# Altium project HAB-Main-Flight-Computer-Card-Template.PrjPcb (part 1 of 4)
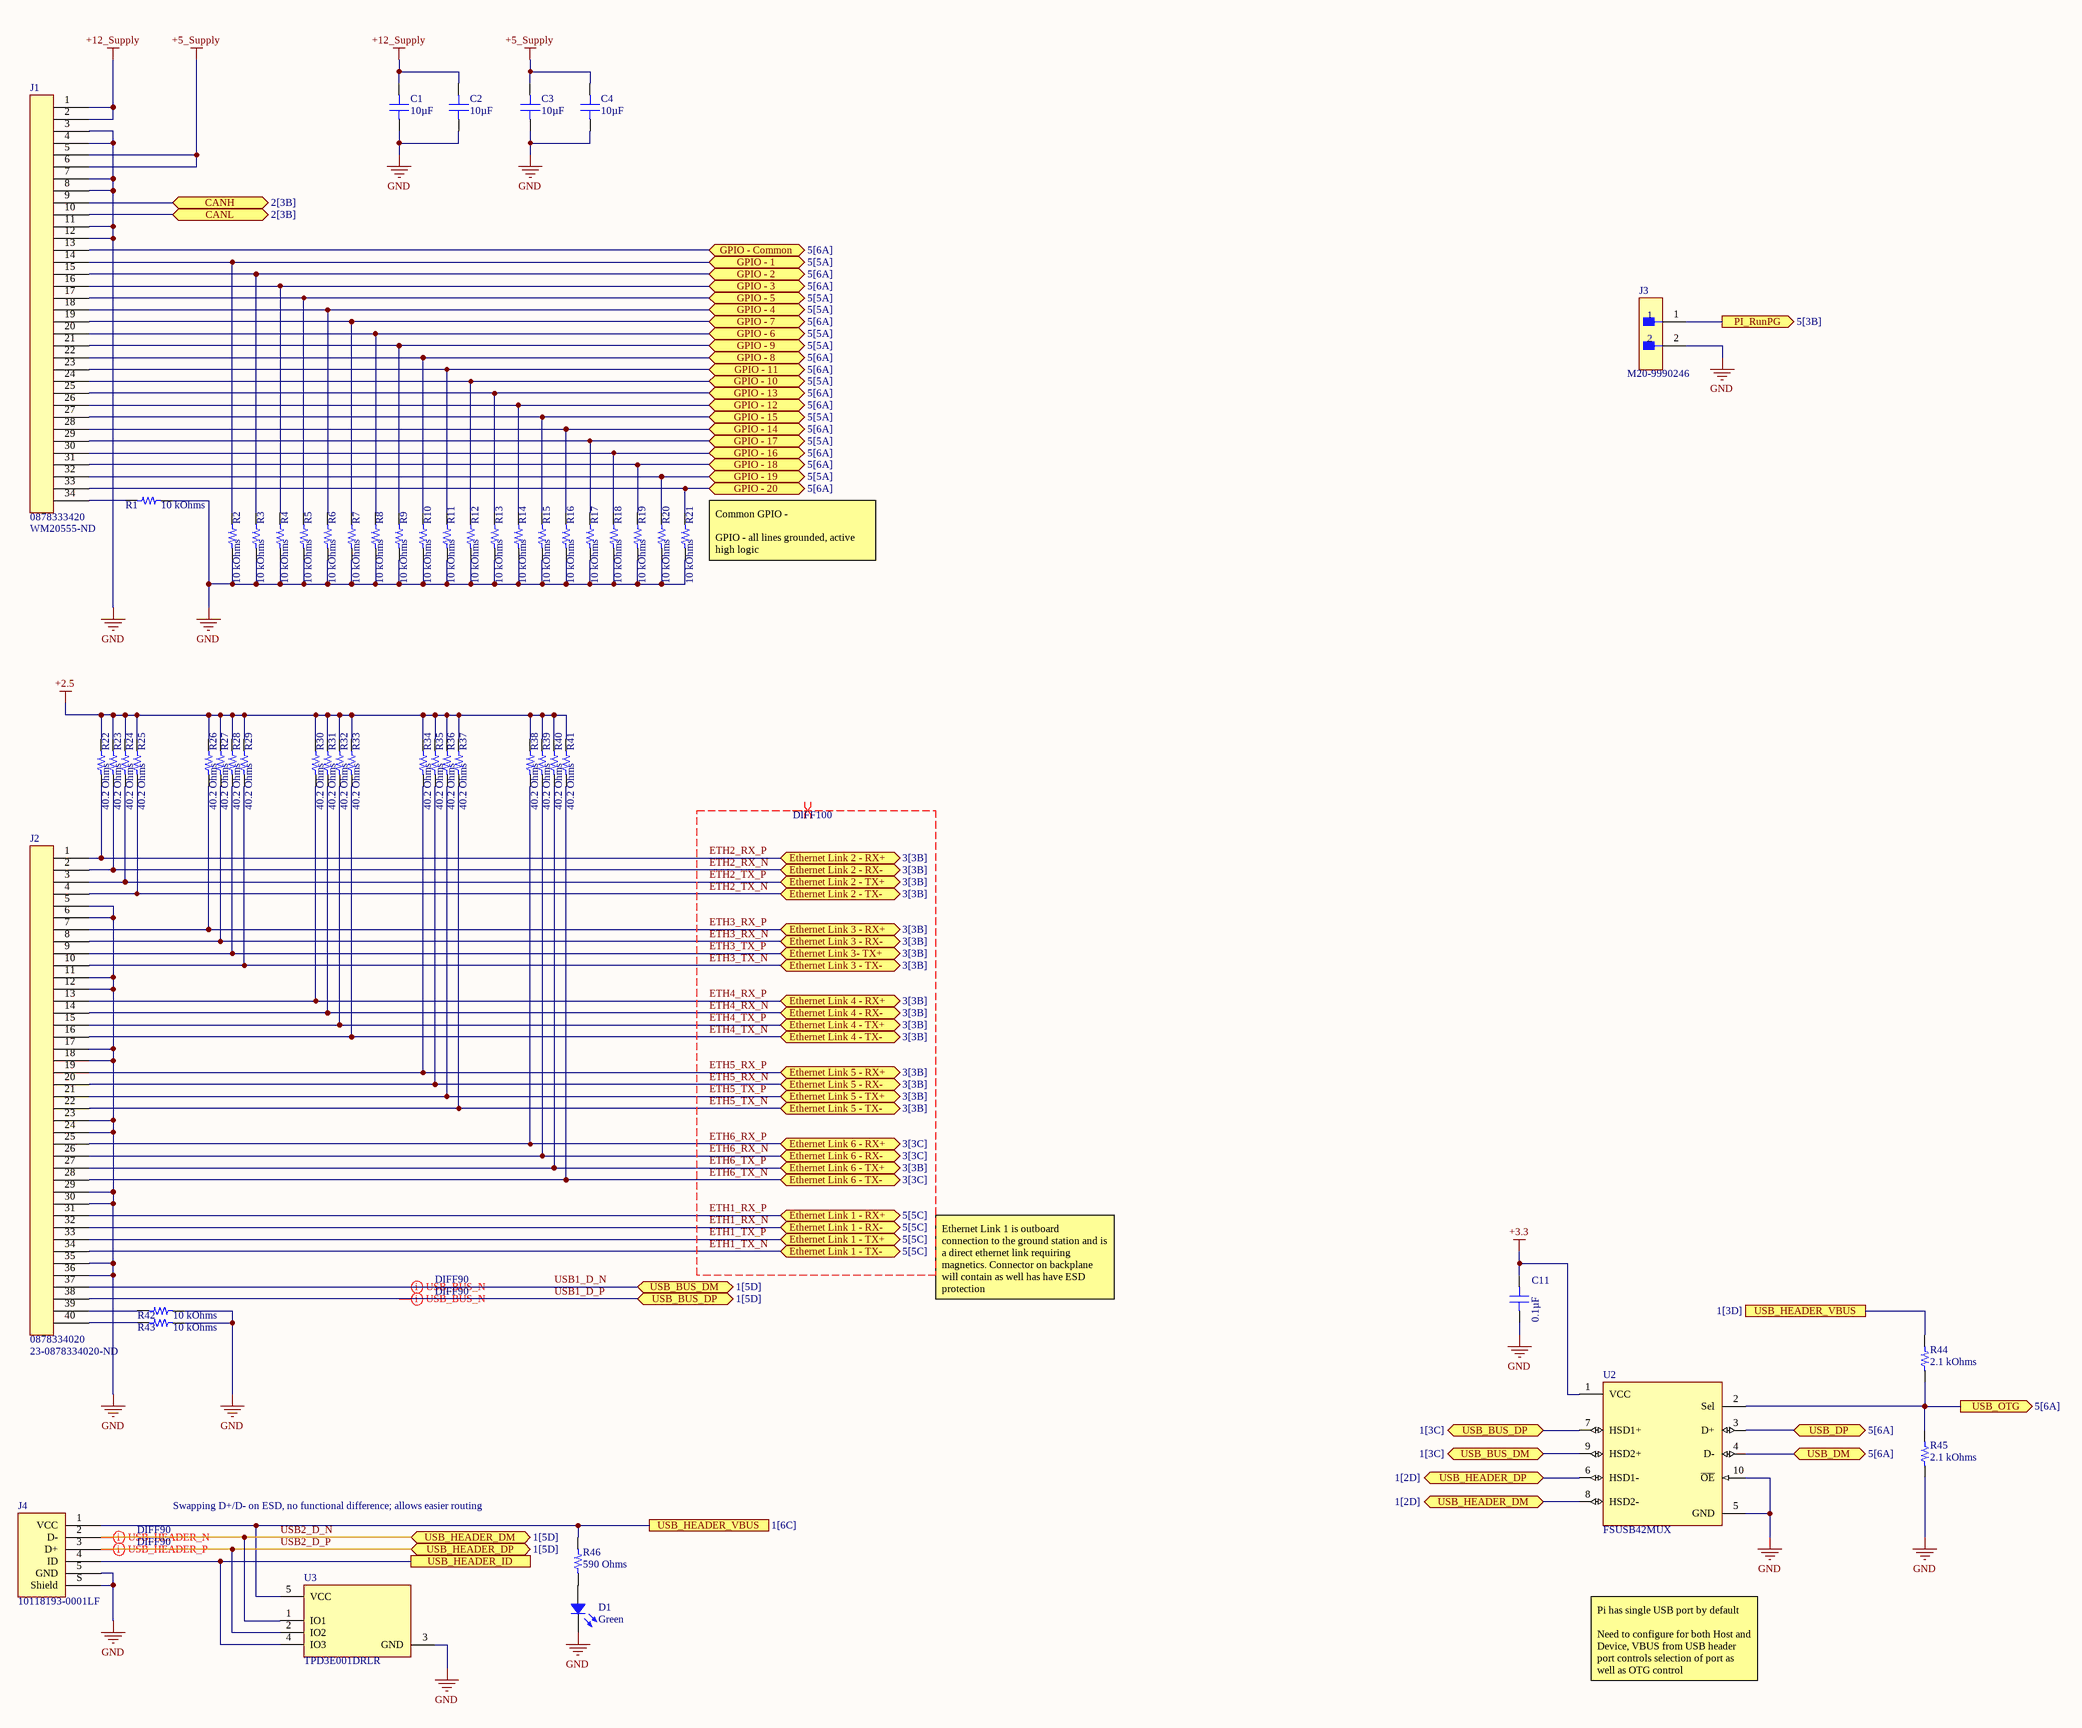
[diagram p0: Interfaces.SchDoc]
7 sheets, 292 parts. Net scope: flat (ports and power ports of the same name join across sheets).
Board file: MFC-Card-Template.PcbDoc
Sheets:
  Interfaces.SchDoc
  CANbus.SchDoc
  NetworkSwitch.SchDoc
  EthernetBridge.SchDoc
  ComputeModule.SchDoc
  Sensors.SchDoc
  Power-Supplies.SchDoc

## Sheet Interfaces.SchDoc: Main Flight Computer Interfaces
size A2; Revision: 1A; SheetNumber: 1; SheetTotal: 7; Organization: Brickworks; Address1: Matthew Glazer; Address2: Design Engineer

### Parts
C1  10µF  [CAP 0805_2012]
C2  10µF  [CAP 0805_2012]
C3  10µF  [CAP 0805_2012]
C4  10µF  [CAP 0805_2012]
C11  0.1µF  [CAP 0603_1608]
D1  Green  [LED 0603_1608 GREEN]
J1  0878333420  Supplier Part Number 1: WM20555-ND  [0878333420]
J2  0878334020  Supplier Part Number 1: 23-0878334020-ND  [0878334020]
J3  M20-9990246  [FP-M20-9990246-MFG]
J4  10118193-0001LF  [FCI USB 10118193-0001LF]
R1  10 kOhms  [RES 0603_1608]
R2  10 kOhms  [RES 0603_1608]
R3  10 kOhms  [RES 0603_1608]
R4  10 kOhms  [RES 0603_1608]
R5  10 kOhms  [RES 0603_1608]
R6  10 kOhms  [RES 0603_1608]
R7  10 kOhms  [RES 0603_1608]
R8  10 kOhms  [RES 0603_1608]
R9  10 kOhms  [RES 0603_1608]
R10  10 kOhms  [RES 0603_1608]
R11  10 kOhms  [RES 0603_1608]
R12  10 kOhms  [RES 0603_1608]
R13  10 kOhms  [RES 0603_1608]
R14  10 kOhms  [RES 0603_1608]
R15  10 kOhms  [RES 0603_1608]
R16  10 kOhms  [RES 0603_1608]
R17  10 kOhms  [RES 0603_1608]
R18  10 kOhms  [RES 0603_1608]
R19  10 kOhms  [RES 0603_1608]
R20  10 kOhms  [RES 0603_1608]
R21  10 kOhms  [RES 0603_1608]
R22  40.2 Ohms  [RES 0603_1608]
R23  40.2 Ohms  [RES 0603_1608]
R24  40.2 Ohms  [RES 0603_1608]
R25  40.2 Ohms  [RES 0603_1608]
R26  40.2 Ohms  [RES 0603_1608]
R27  40.2 Ohms  [RES 0603_1608]
R28  40.2 Ohms  [RES 0603_1608]
R29  40.2 Ohms  [RES 0603_1608]
R30  40.2 Ohms  [RES 0603_1608]
R31  40.2 Ohms  [RES 0603_1608]
R32  40.2 Ohms  [RES 0603_1608]
R33  40.2 Ohms  [RES 0603_1608]
R34  40.2 Ohms  [RES 0603_1608]
R35  40.2 Ohms  [RES 0603_1608]
R36  40.2 Ohms  [RES 0603_1608]
R37  40.2 Ohms  [RES 0603_1608]
R38  40.2 Ohms  [RES 0603_1608]
R39  40.2 Ohms  [RES 0603_1608]
R40  40.2 Ohms  [RES 0603_1608]
R41  40.2 Ohms  [RES 0603_1608]
R42  10 kOhms  [RES 0603_1608]
R43  10 kOhms  [RES 0603_1608]
R44  2.1 kOhms  [RES 0603_1608]
R45  2.1 kOhms  [RES 0603_1608]
R46  590 Ohms  [RES 0603_1608]
U2  FSUSB42MUX  [FP-846AP-MFG]
U3  TPD3E001DRLR  [FP-DRL0005A-MFG]

### Ports
CANH (bidir, see 2[3B]), CANL (bidir, see 2[3B]), Ethernet Link 1 - RX+ (bidir, see 5[5C]), Ethernet Link 1 - RX- (bidir, see 5[5C]), Ethernet Link 1 - TX+ (bidir, see 5[5C]), Ethernet Link 1 - TX- (bidir, see 5[5C]), Ethernet Link 2 - RX+ (bidir, see 3[3B]), Ethernet Link 2 - RX- (bidir, see 3[3B]), Ethernet Link 2 - TX+ (bidir, see 3[3B]), Ethernet Link 2 - TX- (bidir, see 3[3B]), Ethernet Link 3 - RX+ (bidir, see 3[3B]), Ethernet Link 3 - RX- (bidir, see 3[3B]), Ethernet Link 3 - TX- (bidir, see 3[3B]), Ethernet Link 3- TX+ (bidir, see 3[3B]), Ethernet Link 4 - RX+ (bidir, see 3[3B]), Ethernet Link 4 - RX- (bidir, see 3[3B]), Ethernet Link 4 - TX+ (bidir, see 3[3B]), Ethernet Link 4 - TX- (bidir, see 3[3B]), Ethernet Link 5 - RX+ (bidir, see 3[3B]), Ethernet Link 5 - RX- (bidir, see 3[3B]), Ethernet Link 5 - TX+ (bidir, see 3[3B]), Ethernet Link 5 - TX- (bidir, see 3[3B]), Ethernet Link 6 - RX+ (bidir, see 3[3C]), Ethernet Link 6 - RX- (bidir, see 3[3C]), Ethernet Link 6 - TX+ (bidir, see 3[3B]), Ethernet Link 6 - TX- (bidir, see 3[3C]), GPIO - 1 (bidir, see 5[5A]), GPIO - 2 (bidir, see 5[6A]), GPIO - 3 (bidir, see 5[6A]), GPIO - 4 (bidir, see 5[5A]), GPIO - 5 (bidir, see 5[5A]), GPIO - 6 (bidir, see 5[5A]), GPIO - 7 (bidir, see 5[6A]), GPIO - 8 (bidir, see 5[6A]), GPIO - 9 (bidir, see 5[5A]), GPIO - 10 (bidir, see 5[5A]), GPIO - 11 (bidir, see 5[6A]), GPIO - 12 (bidir, see 5[6A]), GPIO - 13 (bidir, see 5[6A]), GPIO - 14 (bidir, see 5[6A]), GPIO - 15 (bidir, see 5[5A]), GPIO - 16 (bidir, see 5[6A]), GPIO - 17 (bidir, see 5[5A]), GPIO - 18 (bidir, see 5[6A]), GPIO - 19 (bidir, see 5[5A]), GPIO - 20 (bidir, see 5[6A]), GPIO - Common (bidir, see 5[6A]), PI_RunPG (out, see 5[3B]), USB_BUS_DM (bidir, see 1[3C]), USB_BUS_DM (bidir, see 1[5D]), USB_BUS_DP (bidir, see 1[3C]), USB_BUS_DP (bidir, see 1[5D]), USB_DM (bidir, see 5[6A]), USB_DP (bidir, see 5[6A]), USB_HEADER_DM (bidir, see 1[2D]), USB_HEADER_DM (bidir, see 1[5D]), USB_HEADER_DP (bidir, see 1[2D]), USB_HEADER_DP (bidir, see 1[5D]), USB_HEADER_ID, USB_HEADER_VBUS (see 1[3D]), USB_HEADER_VBUS (see 1[6C]), USB_OTG (out, see 5[6A])

### Nets
+2.5: R22.2 R23.2 R24.2 R25.2 R26.2 R27.2 R28.2 R29.2 R30.2 R31.2 R32.2 R33.2 R34.2 R35.2 R36.2 R37.2 R38.2 R39.2 R40.2 R41.2
+3.3: C11.2 U2.1(VCC)
+5_Supply: C3.2 C4.2 J1.5 J1.6
+12_Supply: C1.2 C2.2 J1.1 J1.2
GND: C1.1 C2.1 C3.1 C4.1 C11.1 D1.2 J1.3 J1.4 J1.7 J1.8 J1.11 J1.12 J2.5 J2.6 J2.11 J2.12 J2.17 J2.18 J2.23 J2.24 J2.29 J2.30 J2.35 J2.36 J3.2 J4.5(GND) J4.S(Shield) R1.2 R2.1 R3.1 R4.1 R5.1 R6.1 R7.1 R8.1 R9.1 R10.1 R11.1 R12.1 R13.1 R14.1 R15.1 R16.1 R17.1 R18.1 R19.1 R20.1 R21.1 R42.2 R43.2 R45.1 U2.5(GND) U2.10(~{OE}) U3.3(GND)
ETH1_RX_N: J2.32 ; port Ethernet Link 1 - RX-
ETH1_RX_P: J2.31 ; port Ethernet Link 1 - RX+
ETH1_TX_N: J2.34 ; port Ethernet Link 1 - TX-
ETH1_TX_P: J2.33 ; port Ethernet Link 1 - TX+
ETH2_RX_N: J2.2 R23.1 ; port Ethernet Link 2 - RX-
ETH2_RX_P: J2.1 R22.1 ; port Ethernet Link 2 - RX+
ETH2_TX_N: J2.4 R25.1 ; port Ethernet Link 2 - TX-
ETH2_TX_P: J2.3 R24.1 ; port Ethernet Link 2 - TX+
ETH3_RX_N: J2.8 R27.1 ; port Ethernet Link 3 - RX-
ETH3_RX_P: J2.7 R26.1 ; port Ethernet Link 3 - RX+
ETH3_TX_N: J2.10 R29.1 ; port Ethernet Link 3 - TX-
ETH3_TX_P: J2.9 R28.1 ; port Ethernet Link 3- TX+
ETH4_RX_N: J2.14 R31.1 ; port Ethernet Link 4 - RX-
ETH4_RX_P: J2.13 R30.1 ; port Ethernet Link 4 - RX+
ETH4_TX_N: J2.16 R33.1 ; port Ethernet Link 4 - TX-
ETH4_TX_P: J2.15 R32.1 ; port Ethernet Link 4 - TX+
ETH5_RX_N: J2.20 R35.1 ; port Ethernet Link 5 - RX-
ETH5_RX_P: J2.19 R34.1 ; port Ethernet Link 5 - RX+
ETH5_TX_N: J2.22 R37.1 ; port Ethernet Link 5 - TX-
ETH5_TX_P: J2.21 R36.1 ; port Ethernet Link 5 - TX+
ETH6_RX_N: J2.26 R39.1 ; port Ethernet Link 6 - RX-
ETH6_RX_P: J2.25 R38.1 ; port Ethernet Link 6 - RX+
ETH6_TX_N: J2.28 R41.1 ; port Ethernet Link 6 - TX-
ETH6_TX_P: J2.27 R40.1 ; port Ethernet Link 6 - TX+
USB1_D_N: J2.37 U2.9(HSD2+) ; port USB_BUS_DM
USB1_D_P: J2.38 U2.7(HSD1+) ; port USB_BUS_DP
USB2_D_N: J4.2(D-) U2.8(HSD2-) U3.1(IO1) ; port USB_HEADER_DM
USB2_D_P: J4.3(D+) U2.6(HSD1-) U3.2(IO2) ; port USB_HEADER_DP
NetD1_1: D1.1 R46.1
NetD2_1: J1.10 ; port CANL
NetD2_2: J1.9 ; port CANH
NetJ1_13: J1.13 ; port GPIO - Common
NetJ1_14: J1.14 R2.2 ; port GPIO - 1
NetJ1_15: J1.15 R3.2 ; port GPIO - 2
NetJ1_16: J1.16 R4.2 ; port GPIO - 3
NetJ1_17: J1.17 R5.2 ; port GPIO - 5
NetJ1_18: J1.18 R6.2 ; port GPIO - 4
NetJ1_19: J1.19 R7.2 ; port GPIO - 7
NetJ1_20: J1.20 R8.2 ; port GPIO - 6
NetJ1_21: J1.21 R9.2 ; port GPIO - 9
NetJ1_22: J1.22 R10.2 ; port GPIO - 8
NetJ1_23: J1.23 R11.2 ; port GPIO - 11
NetJ1_24: J1.24 R12.2 ; port GPIO - 10
NetJ1_25: J1.25 R13.2 ; port GPIO - 13
NetJ1_26: J1.26 R14.2 ; port GPIO - 12
NetJ1_27: J1.27 R15.2 ; port GPIO - 15
NetJ1_28: J1.28 R16.2 ; port GPIO - 14
NetJ1_29: J1.29 R17.2 ; port GPIO - 17
NetJ1_30: J1.30 R18.2 ; port GPIO - 16
NetJ1_31: J1.31 R19.2 ; port GPIO - 18
NetJ1_32: J1.32 R20.2 ; port GPIO - 19
NetJ1_33: J1.33 R21.2 ; port GPIO - 20
NetJ1_34: J1.34 R1.1
NetJ2_39: J2.39 R42.1
NetJ2_40: J2.40 R43.1
NetJ3_1: J3.1 ; port PI_RunPG
NetJ4_1: J4.1(VCC) R44.2 R46.2 U3.5(VCC) ; port USB_HEADER_VBUS
NetJ4_4: J4.4(ID) U3.4(IO3) ; port USB_HEADER_ID
NetR44_1: R44.1 R45.2 U2.2(Sel) ; port USB_OTG
NetU1_103: U2.4(D-) ; port USB_DM
NetU1_105: U2.3(D+) ; port USB_DP

### Layout directives
differential pair; differential pair class DIFF90: USB1_D_N, USB1_D_P, USB2_D_N, USB2_D_P
differential pair; differential pair class DIFF100: ETH1_RX_N, ETH1_RX_P, ETH1_TX_N, ETH1_TX_P, ETH2_RX_N, ETH2_RX_P, ETH2_TX_N, ETH2_TX_P, ETH3_RX_N, ETH3_RX_P, ETH3_TX_N, ETH3_TX_P, ETH4_RX_N, ETH4_RX_P, ETH4_TX_N, ETH4_TX_P, ETH5_RX_N, ETH5_RX_P, ETH5_TX_N, ETH5_TX_P, ETH6_RX_N, ETH6_RX_P, ETH6_TX_N, ETH6_TX_P

### Notes on the sheet
- (near R21) Common GPIO -
  GPIO - all lines grounded, active high logic
- Ethernet Link 1 is outboard connection to the ground station and is a direct ethernet link requiring magnetics. Connector on backplane will contain as well has have ESD protection
- (near R46) Swapping D+/D- on ESD, no functional difference; allows easier routing
- Pi has single USB port by default
  Need to configure for both Host and Device, VBUS from USB header port controls selection of port as well as OTG control
- Title
- Size:
- Date:
- File:
- A2
- Number:
- Time:
- Revision:
- Sheet
- of

### Library data of the parts
C1-C4 = CC0805KKX5R7BB106: CAP CER 10UF 16V X5R 0805; Manufacturer: Yageo; Tolerance: ±10%; Part Number: CC0805KKX5R7BB106; Value: 10µF; Applications: General Purpose; Capacitance: 10µF; ComponentLink1Description: Datasheet; ComponentLink1URL: https://www.yageo.com/upload/media/product/productsearch/datasheet/mlcc/UPY-GPHC_X5R_4V-to-50V_25.pdf; ComponentLink2Description: DigiKey Link; ComponentLink2URL: http://digikey.com/product-detail/en/yageo/CC0805KKX5R7BB106/311-1865-1-ND/5195767; Device Package: 0805 (2012 Metric); LastUpdated: 9/2/2020 1:04:30 AM; Lifecycle Status: Active; Minimum Order: 1; Mounting Type: Surface Mount, MLCC; Operating Temperature: -55°C ~ 85°C; Package / Case: 0805 (2012 Metric); Packaging: TapeAndReel; PartId: 8867; Part Status: Active; Price: 0.09; Series: CC; Size / Dimension: 0.079" L x 0.049" W (2.00mm x 1.25mm); Supplier 1: DigiKey; Supplier Part Number 1: 311-1865-1-ND; Temperature Coefficient: X5R; Thickness (Max): 0.057" (1.45mm); Voltage - Rated: 16V
C11 = CL10B104KA8WPNC: CAP CER 0.1UF 25V X7R 0603; Manufacturer: Samsung Electro-Mechanics; Tolerance: ±10%; Part Number: CL10B104KA8WPNC; Value: 0.1µF; Applications: Automotive; Capacitance: 0.1µF; ComponentLink1Description: Datasheet; ComponentLink1URL: http://www.samsungsem.com/kr/support/product-search/mlcc/CL10B104KA8WPNC.jsp; ComponentLink2Description: DigiKey Link; ComponentLink2URL: http://digikey.com/product-detail/en/samsung-electro-mechanics/CL10B104KA8WPNC/1276-6717-1-ND/5961576; Device Package: 0603 (1608 Metric); Features: Open Mode; LastUpdated: 9/2/2020 1:03:30 AM; Lifecycle Status: Active; Minimum Order: 1; Mounting Type: Surface Mount, MLCC; Operating Temperature: -55°C ~ 125°C; Package / Case: 0603 (1608 Metric); Packaging: TapeAndReel; PartId: 5631; Part Status: Active; Price: 0.02; Ratings: AEC-Q200; Series: CL; Size / Dimension: 0.063" L x 0.031" W (1.60mm x 0.80mm); Supplier 1: DigiKey; Supplier Part Number 1: 1276-6717-1-ND; Temperature Coefficient: X7R; Thickness (Max): 0.035" (0.90mm); Voltage - Rated: 25V
D1 = LTST-C193KGKT-5A: LED GREEN CLEAR CHIP SMD; Manufacturer: Lite-On Inc.; Configuration: Standard; Current - Test: 5mA; Lens Color: Colorless; Lens Size: 1.15mm x 0.80mm; Lens Style: Rectangle with Flat Top; Millicandela Rating: 16.25mcd; Viewing Angle: 130°; Voltage - Forward (Vf) (Typ): 2V; Wavelength - Dominant: 572nm; Wavelength - Peak: 574nm; Part Number: LTST-C193KGKT-5A; Color: Green; ComponentLink1Description: Datasheet; ComponentLink1URL: http://optoelectronics.liteon.com/upload/download/DS22-2007-0094/LTST-C193KGKT-5A.PDF; ComponentLink2Description: DigiKey Link; ComponentLink2URL: http://digikey.com/product-detail/en/lite-on-inc/LTST-C193KGKT-5A/160-1828-1-ND/2356247; Device Package: 0603 (1608 Metric); Height (Max): 0.45mm; LastUpdated: 9/2/2020 1:20:41 AM; Lens Transparency: Clear; Lifecycle Status: Active; Minimum Order: 1; Mounting Type: Surface Mount; Package / Case: 0603 (1608 Metric); Packaging: TapeAndReel; PartId: 694; Part Status: Active; Price: 0.06; Series: -; Size / Dimension: 1.60mm L x 0.80mm W; Supplier 1: DigiKey; Supplier Part Number 1: 160-1828-1-ND; Supplier Device Package: Chip LED; Value: Green
J3 = CMP-15831-000009-1: CONN HEADER VERT 2POS 2.54MM; Manufacturer: Harwin; Conn Gender: Male; Conn Orientation: Vertical; Number Of Contacts: 2; Current Rating: 3A; ComponentLink2URL: https://cdn.harwin.com/pdfs/M20-999.pdf; ComponentLink2Description: Datasheet; Package: M20-9990246; Temperature: -40°C to +105°C; Octopart: https://octopart.com/m20-9990246-harwin-2590635; Mouser Description: 2.54mm (0.1") Pitch SIL Vertical PC Tail Pin Header, 6.1mm mating pin height, tin, 2 contacts; Temperature Range High: +105°C; Device Class L1: Connectors; RoHS: TRUE; Automotive: No; Height: 8.99mm; Number Of Rows: 1; Contact Material: Tin,Nickel; Category: Conn; Pitch: 2.54mm; Lead Free: Yes; Digikey Description: CONN HEADER VERT 2POS 2.54MM; Manufacturer Part Number: M20-9990246; Temperature Range Low: -40°C; Device Class L3: unset; Device Class L2: Headers and Wire Housings
J4 = 10118193-0001LF: CONN RCPT USB2.0 MICRO B SMD R/A; Manufacturer: Amphenol ICC (FCI); Connector Type: USB - micro B; Current Rating (Amps): 1.8A per Contact; Gender: Receptacle; Mating Cycles: 10000; Number of Contacts: 5; Number of Ports: 1; Shielding: Shielded; Voltage - Rated: 100VAC; Part Number: 10118193-0001LF; ComponentLink1Description: Datasheet; ComponentLink1URL: https://cdn.amphenol-icc.com/media/wysiwyg/files/documentation/datasheet/inputoutput/io_usb_micro.pdf; ComponentLink2Description: DigiKey Link; ComponentLink2URL: //digikey.com/product-detail/en/amphenol-icc-fci/10118193-0001LF/609-4616-2-ND/2785388; Features: Solder Retention; LastUpdated: 12/9/2019 8:51:28 PM; Lifecycle Status: 0; Minimum Order: 1; Mounting Feature: Horizontal; Mounting Type: Surface Mount, Right Angle; Through Hole; Operating Temperature: -30°C ~ 80°C; Packaging: TapeAndReel; Part Status: Active; Price: 0.21; Series: -; Specifications: USB 2.0; Supplier 1: DigiKey; Supplier Part Number 1: 609-4616-2-ND; Termination: Solder
R1-R21 R42 R43 = RMCF0603JT10K0: RES 10K OHM 5% 1/10W 0603; Manufacturer: Stackpole Electronics Inc; Power (Watts): 0.1W, 1/10W; Temperature Coefficient: ±200ppm/°C; Part Number: RMCF0603JT10K0; Value: 10 kOhms; ComponentLink1Description: Datasheet; ComponentLink1URL: https://www.seielect.com/catalog/sei-packaging.pdf; ComponentLink2Description: DigiKey Link; ComponentLink2URL: http://digikey.com/product-detail/en/stackpole-electronics-inc/RMCF0603JT10K0/RMCF0603JT10K0CT-ND/1943191; Composition: Thick Film; Device Package: 0603 (1608 Metric); Features: Automotive AEC-Q200; Height - Seated (Max): 0.022" (0.55mm); LastUpdated: 9/2/2020 1:09:31 AM; Lifecycle Status: Active; Minimum Order: 1; Number of Terminations: 2; Operating Temperature: -55°C ~ 155°C; Package / Case: 0603 (1608 Metric); Packaging: CutTape; PartId: 25659; Part Status: Active; Price: 0.10; Ratings: AEC-Q200; Resistance: 10 kOhms; Series: RMCF; Size / Dimension: 0.061" L x 0.031" W (1.55mm x 0.80mm); Supplier 1: DigiKey; Supplier Part Number 1: RMCF0603JT10K0CT-ND; Supplier Device Package: 0603; Tolerance: ±5%
R22-R41 = RC0603FR-0740R2L: RES SMD 40.2 OHM 1% 1/10W 0603; Manufacturer: Yageo; Power (Watts): 0.1W, 1/10W; Temperature Coefficient: ±100ppm/°C; Part Number: RC0603FR-0740R2L; Value: 40.2 Ohms; ComponentLink1Description: Datasheet; ComponentLink1URL: https://www.yageo.com/upload/media/product/productsearch/datasheet/rchip/PYu-RC_Group_51_RoHS_L_10.pdf; ComponentLink2Description: DigiKey Link; ComponentLink2URL: http://digikey.com/product-detail/en/yageo/RC0603FR-0740R2L/311-40.2HRCT-ND/730167; Composition: Thick Film; Device Package: 0603 (1608 Metric); Features: Moisture Resistant; Height - Seated (Max): 0.022" (0.55mm); LastUpdated: 9/2/2020 1:10:19 AM; Lifecycle Status: Active; Minimum Order: 1; Number of Terminations: 2; Operating Temperature: -55°C ~ 155°C; Package / Case: 0603 (1608 Metric); Packaging: CutTape; PartId: 7714; Part Status: Active; Price: 0.10; Resistance: 40.2 Ohms; Series: RC; Size / Dimension: 0.063" L x 0.031" W (1.60mm x 0.80mm); Supplier 1: DigiKey; Supplier Part Number 1: 311-40.2HRCT-ND; Supplier Device Package: 0603; Tolerance: ±1%
R44 R45 = RMCF0603FT2K10: RES 2.1K OHM 1% 1/10W 0603; Manufacturer: Stackpole Electronics Inc; Power (Watts): 0.1W, 1/10W; Temperature Coefficient: ±100ppm/°C; Part Number: RMCF0603FT2K10; Value: 2.1 kOhms; ComponentLink1Description: Datasheet; ComponentLink1URL: https://www.seielect.com/catalog/sei-rmcf_rmcp.pdf; ComponentLink2Description: DigiKey Link; ComponentLink2URL: http://digikey.com/product-detail/en/stackpole-electronics-inc/RMCF0603FT2K10/RMCF0603FT2K10CT-ND/5049755; Composition: Thick Film; Device Package: 0603 (1608 Metric); Features: Automotive AEC-Q200; Height - Seated (Max): 0.022" (0.55mm); LastUpdated: 9/2/2020 1:10:13 AM; Lifecycle Status: Active; Minimum Order: 1; Number of Terminations: 2; Operating Temperature: -55°C ~ 155°C; Package / Case: 0603 (1608 Metric); Packaging: CutTape; PartId: 10871; Part Status: Active; Price: 0.10; Ratings: AEC-Q200; Resistance: 2.1 kOhms; Series: RMCF; Size / Dimension: 0.061" L x 0.031" W (1.55mm x 0.80mm); Supplier 1: DigiKey; Supplier Part Number 1: RMCF0603FT2K10CT-ND; Supplier Device Package: 0603; Tolerance: ±1%
R46 = RMCF0603FT590R: RES 590 OHM 1% 1/10W 0603; Manufacturer: Stackpole Electronics Inc; Power (Watts): 0.1W, 1/10W; Temperature Coefficient: ±100ppm/°C; Part Number: RMCF0603FT590R; Value: 590 Ohms; ComponentLink1Description: Datasheet; ComponentLink1URL: https://www.seielect.com/catalog/sei-rmcf_rmcp.pdf; ComponentLink2Description: DigiKey Link; ComponentLink2URL: http://digikey.com/product-detail/en/stackpole-electronics-inc/RMCF0603FT590R/RMCF0603FT590RCT-ND/2418096; Composition: Thick Film; Device Package: 0603 (1608 Metric); Features: Automotive AEC-Q200; Height - Seated (Max): 0.022" (0.55mm); LastUpdated: 9/2/2020 1:09:40 AM; Lifecycle Status: Active; Minimum Order: 1; Number of Terminations: 2; Operating Temperature: -55°C ~ 155°C; Package / Case: 0603 (1608 Metric); Packaging: CutTape; PartId: 23847; Part Status: Active; Price: 0.10; Ratings: AEC-Q200; Resistance: 590 Ohms; Series: RMCF; Size / Dimension: 0.061" L x 0.031" W (1.55mm x 0.80mm); Supplier 1: DigiKey; Supplier Part Number 1: RMCF0603FT590RCT-ND; Supplier Device Package: 0603; Tolerance: ±1%
U2 = CMP-07103-000004-1: IC USB SWITCH DPDT 10MSOP; Voltage: 4.3V; Current: 100mA; Number of Inputs: 2; Supply Type: Single; Number of Outputs: 4; Data Rate: 480Mbps; On-State Resistance: 6.5R; Min Supply Voltage: 3V; Package Quantity: 1; Length: 3mm; Radiation Hardening: No; Number of Pins: 10; Width: 3mm; Number of Channels: 2; REACH SVHC: No SVHC; Lead Free: Lead Free; Max Operating Temperature: 85°C; Min Operating Temperature: -40°C; Packaging: Tape and Reel; Throw Configuration: DPDT; Operating Supply Voltage: 4.3V; Max Supply Voltage: 4.3V; Mount: Surface Mount; Case/Package: MSOP; Weight: 0.1125g; Height: 0.85mm
U3 = CMP-0326-00052-4: TVS DIODE 5.5V SOT5; Min Supply Voltage: 900mV; Number of Bidirectional Channels: 3; Peak Pulse Power: 90W; Direction: Unidirectional; Leakage Current: 1nA; Interface: USB; Max Supply Current: 100nA; Capacitance: 1.5pF; Breakdown Voltage: 11V; Clamping Voltage: 105.5V; Power Line Protection: Yes; Packaging: Tape and Reel; Length: 1.6mm; REACH SVHC: No SVHC; Min Operating Temperature: -40°C; Lead Free: Lead Free; Max Supply Voltage: 5.5V; RoHS Compliant: Yes; Termination: SMD/SMT; Number of Channels: 3; Max Supply Voltage (DC): 5.5V; Weight: 9.9E-05oz; Package Quantity: 1; Reverse Standoff Voltage: 5.5V; Number of Pins: 5; Case/Package: SOT-553; Max Operating Temperature: 85°C; Nominal Supply Current: 1nA; Width: 1.2mm; Min Breakdown Voltage: 11V; Min Supply Voltage (DC): 900mV; Height: 0.55mm; Radiation Hardening: No; Depth: 1.2mm
J1 = 0878333420: Supplier 1: Digi-Key
J2 = 0878334020: Supplier 1: Digi-Key

## Sheet CANbus.SchDoc: Main Flight Computer CAN Bus
size A3; Revision: 1A; SheetNumber: 2; SheetTotal: 7; Organization: Brickworks; Address1: Matthew Glazer; Address2: Design Engineer
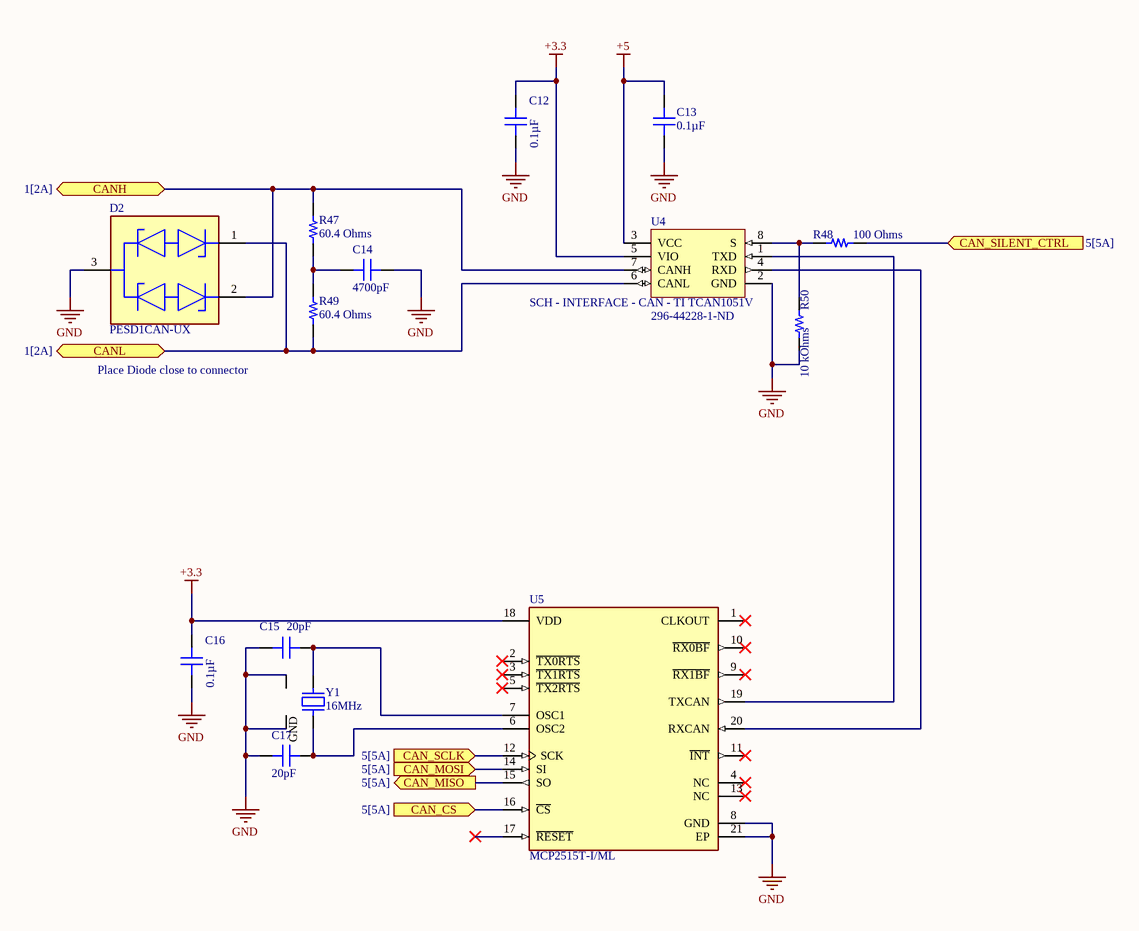
[diagram p1: CANbus.SchDoc]

### Parts
C12  0.1µF  [CAP 0603_1608]
C13  0.1µF  [CAP 0603_1608]
C14  4700pF  [CAP 0603_1608]
C15  20pF  [CAP 0603_1608]
C16  0.1µF  [CAP 0603_1608]
C17  20pF  [CAP 0603_1608]
D2  PESD1CAN-UX  [FP-SOT323-MFG]
R47  60.4 Ohms  [RES 1206_3216]
R48  100 Ohms  [RES 0603_1608]
R49  60.4 Ohms  [RES 1206_3216]
R50  10 kOhms  [RES 0603_1608]
U4  SCH - INTERFACE - CAN - TI TCAN1051V  Supplier Part Number 1: 296-44228-1-ND  [PCB - LEADS - SOIC - TI SOIC-8]
U5  MCP2515T-I/ML  [FP-C04-126-MFG]
Y1  16MHz  [EPSON TSX-3225]

### Ports
CAN_CS (in, see 5[5A]), CAN_MISO (out, see 5[5A]), CAN_MOSI (in, see 5[5A]), CAN_SCLK (in, see 5[5A]), CAN_SILENT_CTRL (in, see 5[5A]), CANH (bidir, see 1[2A]), CANL (bidir, see 1[2A])

### Nets
+3.3: C12.2 C16.2 U4.5(VIO) U5.18(VDD)
+5: C13.2 U4.3(VCC)
GND: C12.1 C13.1 C14.2 C15.1 C16.1 C17.1 D2.3(common_cathode) R50.1 U4.2(GND) U5.8(GND) U5.21(EP) Y1.2(GND) Y1.4(GND)
NetC14_1: C14.1 R47.1 R49.2
NetC15_2: C15.2 U5.7(OSC1) Y1.3
NetC17_2: C17.2 U5.6(OSC2) Y1.1
NetD2_1: D2.1(cathode_1) R49.1 U4.6(CANL) ; port CANL
NetD2_2: D2.2(cathode_2) R47.2 U4.7(CANH) ; port CANH
NetR48_1: R48.1 R50.2 U4.8(S)
NetR48_2: R48.2 ; port CAN_SILENT_CTRL
NetU1_38: U5.12(SCK) ; port CAN_SCLK
NetU1_39: U5.16(~{CS}) ; port CAN_CS
NetU1_40: U5.15(SO) ; port CAN_MISO
NetU1_44: U5.14(SI) ; port CAN_MOSI
NetU4_1: U4.1(TXD) U5.19(TXCAN)
NetU4_4: U4.4(RXD) U5.20(RXCAN)

Not connected (* = marked no-connect by the designer): U5 1(CLKOUT)* 2(~{TX0RTS})* 3(~{TX1RTS})* 4(NC)* 5(~{TX2RTS})* 9(~{RX1BF})* 10(~{RX0BF})* 11(~{INT})* 13(NC)* 17(~{RESET})*

### Notes on the sheet
- Place Diode close to connector
- Title
- Size:
- Date:
- A3
- Number:
- Time:
- Revision:
- Sheet
- of
- File:

### Library data of the parts
C12 C13 C16 = CL10B104KA8WPNC: as C11 on sheet Interfaces; Part Number: CL10B104KA8WPNC; Value: 0.1µF; Applications: Automotive; Capacitance: 0.1µF; ComponentLink1Description: Datasheet; ComponentLink1URL: http://www.samsungsem.com/kr/support/product-search/mlcc/CL10B104KA8WPNC.jsp; ComponentLink2Description: DigiKey Link; ComponentLink2URL: http://digikey.com/product-detail/en/samsung-electro-mechanics/CL10B104KA8WPNC/1276-6717-1-ND/5961576; Device Package: 0603 (1608 Metric); Features: Open Mode; LastUpdated: 9/2/2020 1:03:30 AM; Lifecycle Status: Active; Minimum Order: 1; Mounting Type: Surface Mount, MLCC; Operating Temperature: -55°C ~ 125°C; Package / Case: 0603 (1608 Metric); Packaging: TapeAndReel; PartId: 5631; Part Status: Active; Price: 0.02; Ratings: AEC-Q200; Series: CL; Size / Dimension: 0.063" L x 0.031" W (1.60mm x 0.80mm); Supplier 1: DigiKey; Supplier Part Number 1: 1276-6717-1-ND; Temperature Coefficient: X7R; Thickness (Max): 0.035" (0.90mm); Voltage - Rated: 25V
C14 = VJ0603Y472KXACW1BC: CAP CER 4700PF 50V X7R 0603; Manufacturer: Vishay Vitramon; Tolerance: ±10%; Part Number: VJ0603Y472KXACW1BC; Value: 4700pF; Applications: General Purpose; Capacitance: 4700pF; ComponentLink1Description: Datasheet; ComponentLink1URL: https://www.vishay.com/docs/28548/vjw1bcbascomseries.pdf; ComponentLink2Description: DigiKey Link; ComponentLink2URL: http://digikey.com/product-detail/en/vishay-vitramon/VJ0603Y472KXACW1BC/720-1530-1-ND/421007; Device Package: 0603 (1608 Metric); LastUpdated: 9/2/2020 1:03:13 AM; Lifecycle Status: Active; Minimum Order: 1; Mounting Type: Surface Mount, MLCC; Operating Temperature: -55°C ~ 125°C; Package / Case: 0603 (1608 Metric); Packaging: TapeAndReel; PartId: 14247; Part Status: Active; Price: 0.01; Series: VJ; Size / Dimension: 0.063" L x 0.031" W (1.60mm x 0.80mm); Supplier 1: DigiKey; Supplier Part Number 1: 720-1530-1-ND; Temperature Coefficient: X7R; Thickness (Max): 0.035" (0.90mm); Voltage - Rated: 50V
C15 C17 = CML0603C0G200JT50V: CAP CER 20PF 50V C0G/NP0 0603; Manufacturer: Stackpole Electronics Inc; Temperature Coefficient: C0G, NP0; Tolerance: ±5%; Part Number: CML0603C0G200JT50V; Value: 20pF; Applications: General Purpose; Capacitance: 20pF; ComponentLink1Description: Datasheet; ComponentLink1URL: http://www.seielect.com/Catalog/SEI-CML.PDF; ComponentLink2Description: DigiKey Link; ComponentLink2URL: http://digikey.com/product-detail/en/stackpole-electronics-inc/CML0603C0G200JT50V/738-CML0603C0G200JT50VCT-ND/10660186; Device Package: 0603 (1608 Metric); LastUpdated: 9/2/2020 1:03:28 AM; Lifecycle Status: Active; Minimum Order: 1; Mounting Type: Surface Mount, MLCC; Operating Temperature: -55°C ~ 125°C; Package / Case: 0603 (1608 Metric); Packaging: Unknown; PartId: 26340; Part Status: Active; Price: 0.01; Series: CML_C0G; Supplier 1: DigiKey; Supplier Part Number 1: 738-CML0603C0G200JT50VCT-ND; Voltage - Rated: 50V
D2 = CMP-14436-000006-1: TVS DIODE 24V 50V SC70-3
R47 R49 = ESR18EZPF60R4: RES SMD 60.4 OHM 1% 1/2W 1206; Manufacturer: Rohm Semiconductor; Power (Watts): 0.5W, 1/2W; Temperature Coefficient: ±100ppm/°C; Part Number: ESR18EZPF60R4; ComponentLink1Description: Datasheet; ComponentLink1URL: https://www.rohm.com/datasheet/ESR01MZPF/esr-e; ComponentLink2Description: DigiKey Link; ComponentLink2URL: http://digikey.com/product-detail/en/rohm-semiconductor/ESR18EZPF60R4/RHM60.4AFCT-ND/1983938; Composition: Thick Film; Device Package: 1206 (3216 Metric); Features: Automotive AEC-Q200, Pulse Withstanding; Height - Seated (Max): 0.026" (0.65mm); LastUpdated: 9/2/2020 1:12:41 AM; Lifecycle Status: Active; Minimum Order: 1; Number of Terminations: 2; Operating Temperature: -55°C ~ 155°C; Package / Case: 1206 (3216 Metric); Packaging: TapeAndReel; PartId: 38901; Part Status: Active; Price: 0.02; Ratings: AEC-Q200; Resistance: 60.4 Ohms; Series: ESR; Size / Dimension: 0.126" L x 0.063" W (3.20mm x 1.60mm); Supplier 1: DigiKey; Supplier Part Number 1: RHM60.4AFCT-ND; Supplier Device Package: 1206; Tolerance: ±1%; Value: 60.4 Ohms
R48 = RMCF0603FG100R: RES 100 OHM 1% 1/10W 0603; Manufacturer: Stackpole Electronics Inc; Power (Watts): 0.1W, 1/10W; Temperature Coefficient: ±100ppm/°C; Part Number: RMCF0603FG100R; Value: 100 Ohms; ComponentLink1Description: Datasheet; ComponentLink1URL: https://www.seielect.com/catalog/sei-rmcf_rmcp.pdf; ComponentLink2Description: DigiKey Link; ComponentLink2URL: http://digikey.com/product-detail/en/stackpole-electronics-inc/RMCF0603FG100R/RMCF0603FG100RCT-ND/4425033; Composition: Thick Film; Device Package: 0603 (1608 Metric); Features: Automotive AEC-Q200; Height - Seated (Max): 0.022" (0.55mm); LastUpdated: 9/2/2020 1:09:39 AM; Lifecycle Status: Active; Minimum Order: 1; Number of Terminations: 2; Operating Temperature: -55°C ~ 155°C; Package / Case: 0603 (1608 Metric); Packaging: CutTape; PartId: 24036; Part Status: Active; Price: 0.10; Ratings: AEC-Q200; Resistance: 100 Ohms; Series: RMCF; Size / Dimension: 0.061" L x 0.031" W (1.55mm x 0.80mm); Supplier 1: DigiKey; Supplier Part Number 1: RMCF0603FG100RCT-ND; Supplier Device Package: 0603; Tolerance: ±1%
R50 = RMCF0603JT10K0: as R1 on sheet Interfaces; Part Number: RMCF0603JT10K0; Value: 10 kOhms; ComponentLink1Description: Datasheet; ComponentLink1URL: https://www.seielect.com/catalog/sei-packaging.pdf; ComponentLink2Description: DigiKey Link; ComponentLink2URL: http://digikey.com/product-detail/en/stackpole-electronics-inc/RMCF0603JT10K0/RMCF0603JT10K0CT-ND/1943191; Composition: Thick Film; Device Package: 0603 (1608 Metric); Features: Automotive AEC-Q200; Height - Seated (Max): 0.022" (0.55mm); LastUpdated: 9/2/2020 1:09:31 AM; Lifecycle Status: Active; Minimum Order: 1; Number of Terminations: 2; Operating Temperature: -55°C ~ 155°C; Package / Case: 0603 (1608 Metric); Packaging: CutTape; PartId: 25659; Part Status: Active; Price: 0.10; Ratings: AEC-Q200; Resistance: 10 kOhms; Series: RMCF; Size / Dimension: 0.061" L x 0.031" W (1.55mm x 0.80mm); Supplier 1: DigiKey; Supplier Part Number 1: RMCF0603JT10K0CT-ND; Supplier Device Package: 0603; Tolerance: ±5%
U5 = CMP-0186-00186-2: IC CAN CTLR W/SPI 2.0B 20-QFN; Max Supply Voltage: 5.5V; Max Supply Current: 10mA; Number of Transceivers: 1; Min Supply Voltage: 2.7V; Data Rate: 1000Kbps; Interface: SPI; Mount: Surface Mount; Packaging: Tape and Reel; Lead Free: Lead Free; Package Quantity: 3300; Case/Package: QFN; Max Operating Temperature: 85°C; Number of Pins: 20; Min Operating Temperature: -40°C; Contact Plating: Tin; Radiation Hardening: No; Nominal Supply Current: 10mA
Y1 = TSX-3225 16.0000MF10U-B0: CRYSTAL 16.00 MHZ 16.0PF SMD; Manufacturer: EPSON; ESR (Equivalent Series Resistance): 60 Ohms; Frequency Stability: ±10ppm; Load Capacitance: 16pF; Operating Mode: Fundamental; Part Number: TSX-3225 16.0000MF10U-B0; ComponentLink1Description: Datasheet; ComponentLink1URL: https://support.epson.biz/td/api/doc_check.php?dl=brief_TSX-3225&lang=en; ComponentLink2Description: DigiKey Link; ComponentLink2URL: http://digikey.com/product-detail/en/epson/TSX-3225-16.0000MF10U-B0/SER4370CT-ND/7932354; Frequency: 16MHz; Frequency Tolerance: ±10ppm; Height - Seated (Max): 0.024" (0.60mm); LastUpdated: 9/2/2020 1:21:55 AM; Lifecycle Status: Active; Minimum Order: 1; Mounting Type: Surface Mount; Operating Temperature: -10°C ~ 60°C; Package / Case: 4-SMD, No Lead; Packaging: TapeAndReel; PartId: 436; Part Status: Active; Price: 0.18; Series: TSX-3225; Size / Dimension: 0.126" L x 0.098" W (3.20mm x 2.50mm); Supplier 1: DigiKey; Supplier Part Number 1: SER4370CT-ND; Type: MHz Crystal; Value: 16MHz
U4 = SCH - INTERFACE - CAN - TI TCAN1051V: Supplier 1: Digi-Key